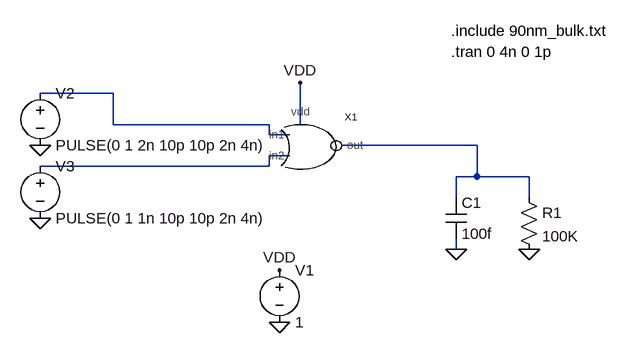
[diagram p0: schematic nor-test.asc]
nor-test.asc, the LTspice schematic file:
Version 4
SHEET 1 880 680
WIRE -384 -96 -496 -96
WIRE -384 -48 -384 -96
WIRE -144 -48 -384 -48
WIRE -96 -48 -96 -112
WIRE -144 -32 -144 -48
WIRE -112 -32 -144 -32
WIRE 176 -16 -32 -16
WIRE -112 0 -144 0
WIRE -144 16 -144 0
WIRE -144 16 -496 16
WIRE 176 32 176 -16
WIRE 176 32 144 32
WIRE 256 32 176 32
WIRE 144 64 144 32
WIRE 256 64 256 32
WIRE 144 144 144 128
FLAG -96 -112 VDD
FLAG -128 176 VDD
FLAG -128 256 0
FLAG 144 144 0
FLAG 256 144 0
FLAG -496 -16 0
FLAG -496 96 0
SYMBOL voltage -128 160 R0
WINDOW 123 0 0 Left 2
WINDOW 39 0 0 Left 2
SYMATTR InstName V1
SYMATTR Value 1
SYMBOL voltage -496 -112 R0
WINDOW 123 0 0 Left 2
WINDOW 39 0 0 Left 2
SYMATTR InstName V2
SYMATTR Value PULSE(0 1 2n 10p 10p 2n 4n)
SYMBOL res 240 48 R0
SYMATTR InstName R1
SYMATTR Value 100K
SYMBOL cap 128 64 R0
SYMATTR InstName C1
SYMATTR Value 100f
SYMBOL voltage -496 0 R0
WINDOW 123 0 0 Left 2
WINDOW 39 0 0 Left 2
SYMATTR InstName V3
SYMATTR Value PULSE(0 1 1n 10p 10p 2n 4n)
SYMBOL nor -96 -16 R0
SYMATTR InstName X1
TEXT 136 -160 Left 2 !.tran 0 4n 0 1p
TEXT 136 -192 Left 2 !.include 90nm_bulk.txt

The netlist it stands for:
* nor-test.asc
V1 VDD 0 1
V2 N001 0 PULSE(0 1 2n 10p 10p 2n 4n)
R1 N002 0 100K
C1 N002 0 100f
V3 N003 0 PULSE(0 1 1n 10p 10p 2n 4n)
XX1 N001 N003 VDD N002 nor  ; pins in1 in2 vdd out
.tran 0 4n 0 1p
.include 90nm_bulk.txt
.backanno
.end